# EAGLE design adaptm-m (EAGLE 4.13)
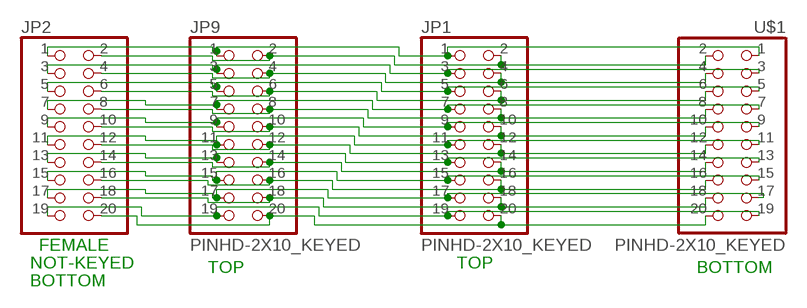
[diagram p0: schematic, sheet 1]

## Parts
JP1  PINHD-2X10_KEYED  [2X10_KEYED]
JP2  PINHD-2X10  [2X10]
JP9  PINHD-2X10_KEYED  [2X10_KEYED]
U$1  PINHD-2X10_KEYED  [2X10_KEYED]

## Nets
N$1: JP1.1 JP2.1 JP9.1 U$1.1
N$2: JP1.2 JP2.2 JP9.2 U$1.2
N$3: JP1.3 JP2.3 JP9.3 U$1.3
N$4: JP1.4 JP2.4 JP9.4 U$1.4
N$5: JP1.5 JP2.5 JP9.5 U$1.5
N$6: JP1.6 JP2.6 JP9.6 U$1.6
N$7: JP1.7 JP2.7 JP9.7 U$1.7
N$8: JP1.8 JP2.8 JP9.8 U$1.8
N$9: JP1.9 JP2.9 JP9.9 U$1.9
N$10: JP1.10 JP2.10 JP9.10 U$1.10
N$11: JP1.11 JP2.11 JP9.11 U$1.11
N$12: JP1.12 JP2.12 JP9.12 U$1.12
N$13: JP1.13 JP2.13 JP9.13 U$1.13
N$14: JP1.14 JP2.14 JP9.14 U$1.14
N$15: JP1.15 JP2.15 JP9.15 U$1.15
N$16: JP1.16 JP2.16 JP9.16 U$1.16
N$17: JP1.17 JP2.17 JP9.17 U$1.17
N$18: JP1.18 JP2.18 JP9.18 U$1.18
N$19: JP1.19 JP2.19 JP9.19 U$1.19
N$20: JP1.20 JP2.20 JP9.20 U$1.20

## Notes on the sheet
- FEMALE
- NOT-KEYED | TOP | TOP | BOTTOM
- BOTTOM

## Library data of the parts
JP1 JP9 U$1 = pinhead:PINHD-2X10_KEYED
JP2 = pinhead:PINHD-2X10: PIN HEADER

## Board
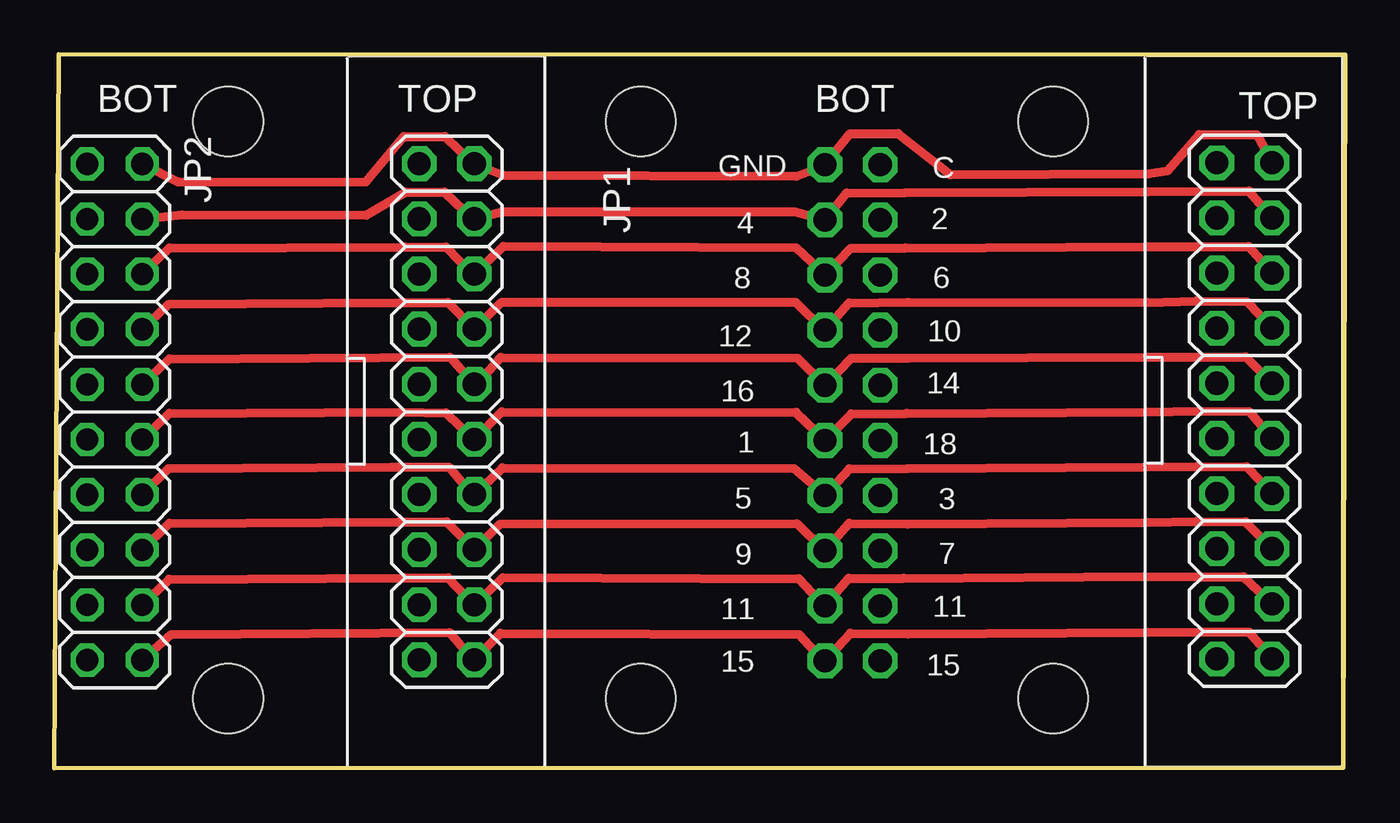
[diagram p1: board, top side]
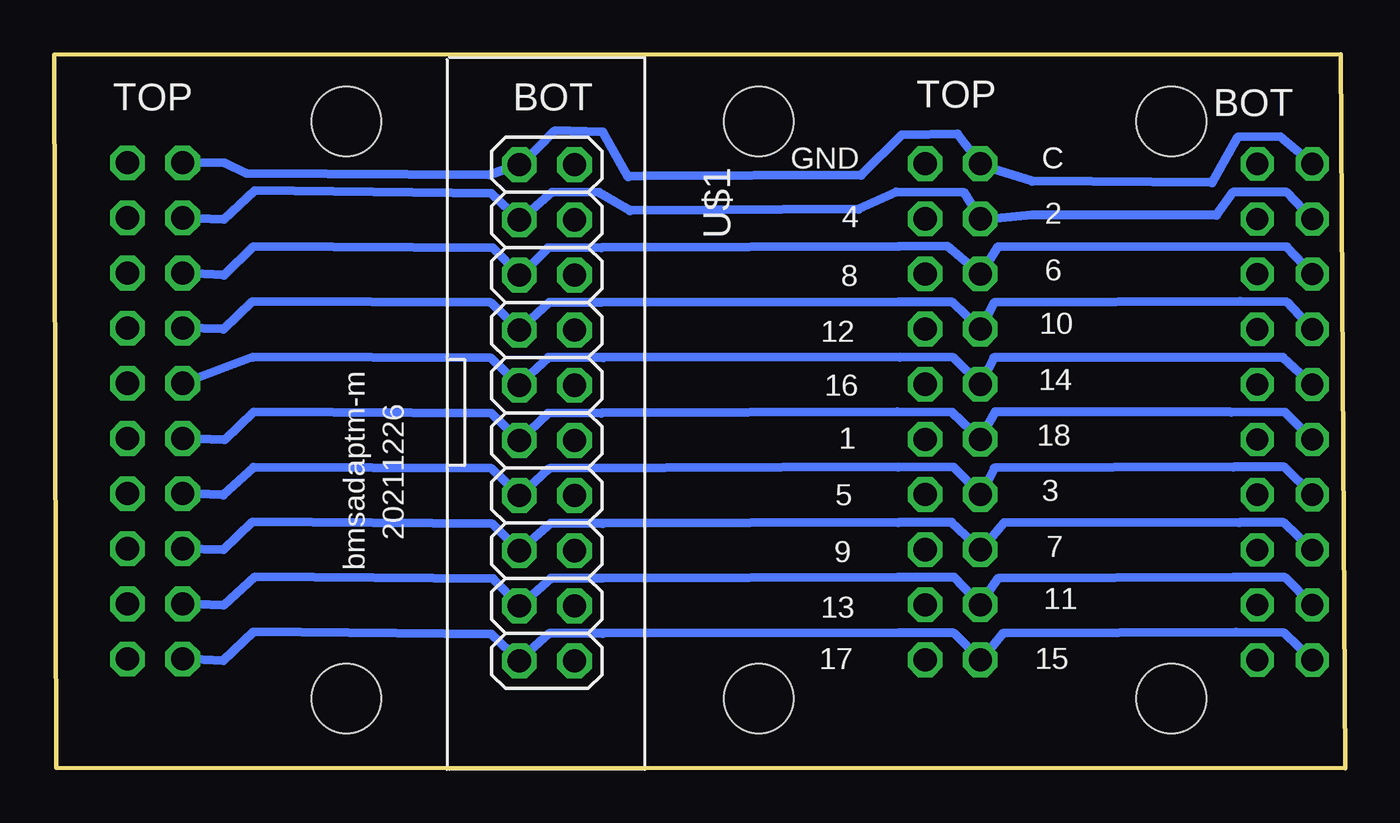
[diagram p2: board, bottom side, seen from below]

Size 59.46 x 32.9 mm. Coordinates in mm from the lower left corner, seen from the top.
Outline: 0,0 0.2,32.9 59.46,32.87 59.38,0.02 0,0
Copper layers (1*16): Top 0.035mm / dielectric 1.5mm / Bottom 0.035mm
Design rules "default": minimum track width 8mil, minimum drill 0.6mm, track to track 8mil, track to pad 8mil, pad to pad 8mil, via to via 8mil, smd to smd 0mil, copper to edge 8mil, drill to drill 8mil, minimum pad ring 10mil, minimum via ring 8mil, stop-mask expansion 4mil, vias tented up to drill 0mil, thermal gap 10mil
Holes 3.2 mm at 8.01,3.21 27.01,3.21 46.01,3.21 46.01,29.81 27.01,29.81 8.01,29.81

### Footprints (pad centres in the part's own frame; a part is rotated, then mirrored left to right if it is on the bottom)
2X10_KEYED = drill 1.067 octagon: 1 -11.46,-1.27; 2 -11.46,1.27; 3 -8.92,-1.27; 4 -8.92,1.27; 5 -6.38,-1.27; 6 -6.38,1.27; 7 -3.84,-1.27; 8 -3.84,1.27; 9 -1.3,-1.27; 10 -1.3,1.27; 11 1.24,-1.27; 12 1.24,1.27; 13 3.78,-1.27; 14 3.78,1.27; 15 6.32,-1.27; 16 6.32,1.27; 17 8.86,-1.27; 18 8.86,1.27; 19 11.4,-1.27; 20 11.4,1.27
2X10 = drill 1.016 octagon: 1 -11.43,-1.27; 2 -11.43,1.27; 3 -8.89,-1.27; 4 -8.89,1.27; 5 -6.35,-1.27; 6 -6.35,1.27; 7 -3.81,-1.27; 8 -3.81,1.27; 9 -1.27,-1.27; 10 -1.27,1.27; 11 1.27,-1.27; 12 1.27,1.27; 13 3.81,-1.27; 14 3.81,1.27; 15 6.35,-1.27; 16 6.35,1.27; 17 8.89,-1.27; 18 8.89,1.27; 19 11.43,-1.27; 20 11.43,1.27

### Placement (x,y rotation side)
JP1  18.08,16.4 270 top
JP2  2.78,16.42 270 top
JP9  54.82,16.44 270 top
U$1  36.77,16.35 270 bottom

### Tracks (layer width: path | path; a pad name or v marks a point on that pad's centre or on a via)
N$1
  Bottom 0.406: JP2.1 2.99,29.1 4.97,29.07 6.14,26.98 14.41,27.05 16.8,27.79 JP1.1 17.85,29.23 20.43,29.18 22.3,27.32 32.28,27.29 33.03,27.26 34.19,29.32 36.41,29.37 37.97,27.78 U$1.1 39.43,27.34 50.62,27.41 51.62,27.89 JP9.1
N$2
  Top 0.406: JP2.2 5.73,27.02 14.36,27.03 16.09,29.11 17.99,29.11 19.33,27.81 JP1.2 20.68,27.32 34.18,27.28 35.53,27.79 U$1.2 36.65,29.24 38.86,29.25 41.27,27.35 50.4,27.4 51.3,27.54 52.73,29.2 55.39,29.19 JP9.2
N$3
  Bottom 0.406: JP2.3 2.7,26.54 5.17,26.54 5.93,25.48 14.43,25.49 16.81,25.26 JP1.3 17.53,26.52 20.68,26.55 22.41,25.76 32.95,25.69 34.36,26.53 36.54,26.54 38.04,25.24 U$1.3 39.32,26.48 50.24,26.61 51.65,25.29 JP9.3
N$4
  Top 0.406: JP2.4 5.88,25.51 14.37,25.48 16.18,26.55 17.97,26.55 19.3,25.31 JP1.4 20.64,25.66 34.12,25.64 35.48,25.29 U$1.4 36.49,26.51 39.18,26.52 50.36,26.56 52.79,26.6 55.03,26.6 JP9.4
N$5
  Bottom 0.406: JP2.5 2.68,24.02 15.99,24.03 16.78,22.8 JP1.5 18.33,24.06 20.54,24.05 34.27,23.99 36.72,23.98 37.97,22.73 U$1.5 39.26,23.98 50.29,24.03 51.64,22.72 JP9.5
N$6
  Top 0.406: JP2.6 5.3,23.97 16.13,24.02 18.04,24.02 19.29,22.73 JP1.6 20.69,24.06 34.17,23.99 35.49,22.75 U$1.6 36.7,23.96 39.22,23.97 50.27,24.05 55.01,24.05 JP9.6
N$7
  Bottom 0.406: JP2.7 2.67,21.48 4.84,21.51 16.18,21.46 16.83,20.2 JP1.7 18.1,21.48 20.57,21.49 34.26,21.47 36.66,21.47 38.07,20.17 U$1.7 39.35,21.46 50.34,21.5 51.66,20.23 JP9.7
N$8
  Top 0.406: JP2.8 5.27,21.39 15.96,21.47 18.13,21.47 19.32,20.26 JP1.8 20.61,21.48 34.13,21.48 35.49,20.15 U$1.8 36.61,21.44 39.34,21.48 50.33,21.47 52.62,21.53 54.92,21.5 JP9.8
N$9
  Bottom 0.406: JP2.9 2.87,18.93 5.26,18.93 16.19,18.92 16.83,17.65 JP1.9 18.04,18.92 20.51,18.95 34.18,18.92 36.7,18.93 38.09,17.64 U$1.9 39.33,18.9 50.3,18.95 JP9.9
N$10
  Top 0.406: JP2.10 5.3,18.86 18.22,18.95 19.4,17.62 | 19.4,17.62 JP1.10 | 19.4,17.62 20.56,18.93 34.23,18.9 35.53,17.65 U$1.10 36.71,18.9 39.34,18.9 50.29,18.94 52.68,18.95 54.87,18.96 JP9.10
N$11
  Bottom 0.406: JP2.11 2.77,16.4 5.26,16.41 16.13,16.42 16.83,15.19 JP1.11 18.11,16.4 20.63,16.42 34.27,16.37 36.72,16.36 38.01,15.13 U$1.11 39.32,16.35 50.28,16.41 51.62,15.14 JP9.11
N$12
  Top 0.406: JP2.12 5.3,16.35 16.02,16.41 18.04,16.38 19.35,15.1 JP1.12 20.61,16.42 34.17,16.4 U$1.12 36.71,16.33 39.27,16.35 50.29,16.43 52.75,16.46 55.04,16.44 JP9.12
N$13
  Bottom 0.406: JP2.13 2.8,13.88 5.16,13.88 16.16,13.83 16.77,12.6 JP1.13 18.03,13.87 20.59,13.88 36.66,13.81 38.04,12.54 U$1.13 39.31,13.81 50.28,13.87 51.67,12.59 JP9.13
N$14
  Top 0.406: JP2.14 5.26,13.81 15.52,13.88 18.18,13.88 19.3,12.56 JP1.14 20.64,13.85 34.07,13.81 35.5,12.59 U$1.14 36.62,13.8 39.28,13.81 50.23,13.89 52.66,13.91 54.92,13.89 JP9.14
N$15
  Bottom 0.406: JP2.15 2.83,11.32 4.88,11.33 15.71,11.31 16.78,10.07 JP1.15 18.13,11.34 20.59,11.33 34.2,11.28 36.6,11.29 38.1,9.98 U$1.15 39.27,11.26 50.34,11.35 51.68,10.07 JP9.15
N$16
  Top 0.406: JP2.16 5.3,11.29 15.9,11.36 18.07,11.36 19.33,10.08 JP1.16 20.54,11.26 34.2,11.28 35.48,10.05 U$1.16 36.61,11.29 39.3,11.26 50.29,11.34 52.63,11.38 54.86,11.36 JP9.16
N$17
  Bottom 0.406: JP2.17 2.77,8.79 5.14,8.8 16,8.75 16.84,7.51 JP1.17 18.01,8.8 20.6,8.8 34.21,8.76 36.59,8.76 38.04,7.46 U$1.17 39.24,8.74 50.22,8.82 51.66,7.51 JP9.17
N$18
  Top 0.406: JP2.18 5.29,8.71 16.13,8.78 18.15,8.78 19.3,7.55 JP1.18 20.66,8.79 34.29,8.73 35.48,7.47 U$1.18 36.58,8.76 39.12,8.76 50.19,8.84 52.68,8.83 54.77,8.83 JP9.18
N$19
  Bottom 0.406: JP2.19 2.8,6.24 5.03,6.27 15.77,6.22 16.74,5.03 JP1.19 18.03,6.24 20.54,6.25 34.2,6.21 36.67,6.21 38.07,4.96 U$1.19 39.32,6.18 50.28,6.28 51.67,4.96 JP9.19
N$20
  Top 0.406: JP2.20 5.39,6.17 18.2,6.26 19.33,4.92 JP1.20 20.55,6.23 34.31,6.17 35.45,4.91 U$1.20 36.66,6.23 39.3,6.19 50.31,6.27 52.79,6.28 55.02,6.28 JP9.20

### Text on the board
tNames: BOT | TOP | BOT | TOP | GND | C | 4 | 2 | 8 | 6 | 10 | 12 | 16 | 14 | 1 | 18 | 5 | 3 | 9 | 7 | 11 | 11 | 15 | 15
bNames: BOT | TOP | BOT | TOP | C | GND | 2 | 4 | 6 | 8 | 10 | 12 | bmsadaptm-m | 14 | 16 | 20211226 | 18 | 1 | 3 | 5 | 7 | 9 | 11 | 13 | 15 | 17
tValues: 3.3V | DIGITAL | +5V | 3.2v | ANALOG | 3.2